# Altium schematic sheet Zynq.SchDoc
size A3; SheetNumber: 2; SheetTotal: 3
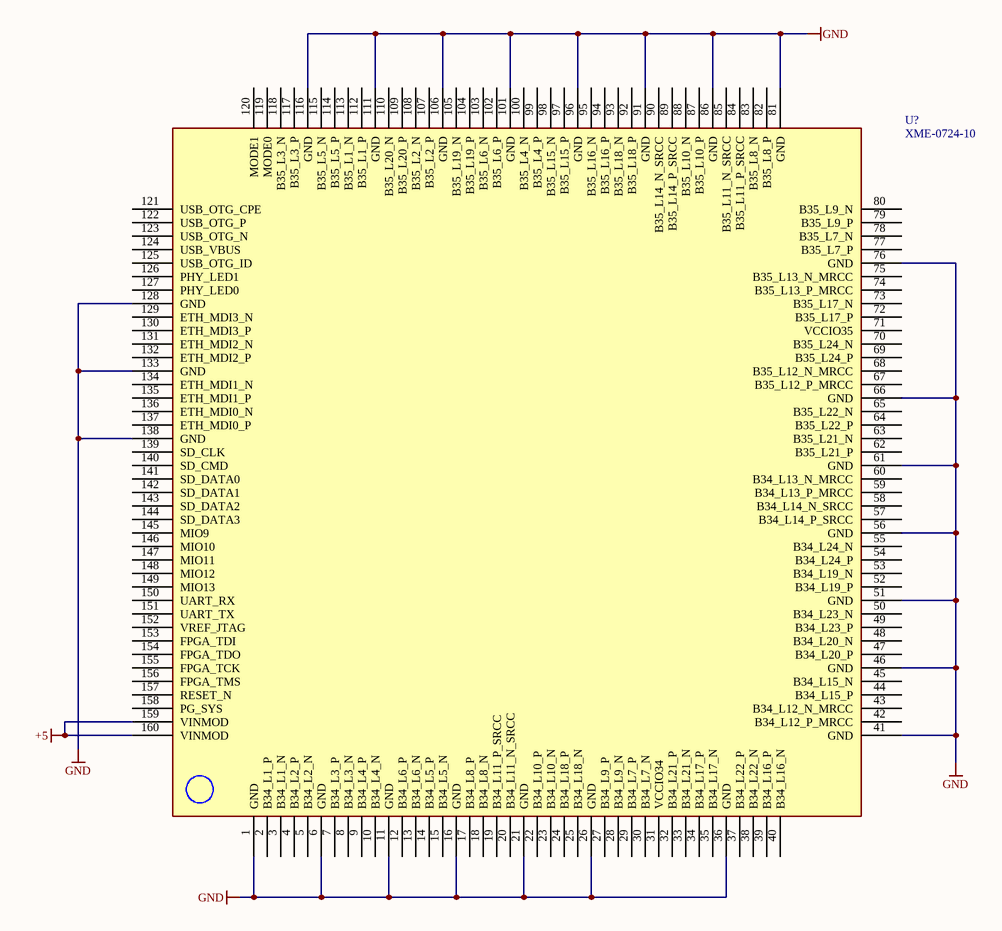
[diagram p0: Zynq.SchDoc]

## Parts
U?  XME-0724-10  [XME-0724-10-Footprint-1]

## Nets
+5: U?.159(VINMOD) U?.160(VINMOD)
GND: U?.1(GND) U?.6(GND) U?.11(GND) U?.16(GND) U?.21(GND) U?.26(GND) U?.36(GND) U?.41(GND) U?.46(GND) U?.51(GND) U?.56(GND) U?.61(GND) U?.66(GND) U?.76(GND) U?.81(GND) U?.86(GND) U?.91(GND) U?.96(GND) U?.101(GND) U?.106(GND) U?.111(GND) U?.116(GND) U?.128(GND) U?.133(GND) U?.138(GND)

Not connected (* = marked no-connect by the designer): U? 2(B34_L1_P) 3(B34_L1_N) 4(B34_L2_P) 5(B34_L2_N) 7(B34_L3_P) 8(B34_L3_N) 9(B34_L4_P) 10(B34_L4_N) 12(B34_L6_P) 13(B34_L6_N) 14(B34_L5_P) 15(B34_L5_N) 17(B34_L8_P) 18(B34_L8_N) 19(B34_L11_P_SRCC) 20(B34_L11_N_SRCC) 22(B34_L10_P) 23(B34_L10_N) 24(B34_L18_P) 25(B34_L18_N) 27(B34_L9_P) 28(B34_L9_N) 29(B34_L7_P) 30(B34_L7_N) 31(VCCIO34) 32(B34_L21_P) 33(B34_L21_N) 34(B34_L17_P) 35(B34_L17_N) 37(B34_L22_P) 38(B34_L22_N) 39(B34_L16_P) 40(B34_L16_N) 42(B34_L12_P_MRCC) 43(B34_L12_N_MRCC) 44(B34_L15_P) 45(B34_L15_N) 47(B34_L20_P) 48(B34_L20_N) 49(B34_L23_P) 50(B34_L23_N) 52(B34_L19_P) 53(B34_L19_N) 54(B34_L24_P) 55(B34_L24_N) 57(B34_L14_P_SRCC) 58(B34_L14_N_SRCC) 59(B34_L13_P_MRCC) 60(B34_L13_N_MRCC) 62(B35_L21_P) 63(B35_L21_N) 64(B35_L22_P) 65(B35_L22_N) 67(B35_L12_P_MRCC) 68(B35_L12_N_MRCC) 69(B35_L24_P) 70(B35_L24_N) 71(VCCIO35) 72(B35_L17_P) 73(B35_L17_N) 74(B35_L13_P_MRCC) 75(B35_L13_N_MRCC) 77(B35_L7_P) 78(B35_L7_N) 79(B35_L9_P) 80(B35_L9_N) 82(B35_L8_P) 83(B35_L8_N) 84(B35_L11_P_SRCC) 85(B35_L11_N_SRCC) 87(B35_L10_P) 88(B35_L10_N) 89(B35_L14_P_SRCC) 90(B35_L14_N_SRCC) 92(B35_L18_P) 93(B35_L18_N) 94(B35_L16_P) 95(B35_L16_N) 97(B35_L15_P) 98(B35_L15_N) 99(B35_L4_P) 100(B35_L4_N) 102(B35_L6_P) 103(B35_L6_N) 104(B35_L19_P) 105(B35_L19_N) 107(B35_L2_P) 108(B35_L2_N) 109(B35_L20_P) 110(B35_L20_N) 112(B35_L1_P) 113(B35_L1_N) 114(B35_L5_P) 115(B35_L5_N) 117(B35_L3_P) 118(B35_L3_N) 119(MODE0) 120(MODE1) 121(USB_OTG_CPE) 122(USB_OTG_P) 123(USB_OTG_N) 124(USB_VBUS) 125(USB_OTG_ID) 126(PHY_LED1) 127(PHY_LED0) 129(ETH_MDI3_N) 130(ETH_MDI3_P) 131(ETH_MDI2_N) 132(ETH_MDI2_P) 134(ETH_MDI1_N) 135(ETH_MDI1_P) 136(ETH_MDI0_N) 137(ETH_MDI0_P) 139(SD_CLK) 140(SD_CMD) 141(SD_DATA0) 142(SD_DATA1) 143(SD_DATA2) 144(SD_DATA3) 145(MIO9) 146(MIO10) 147(MIO11) 148(MIO12) 149(MIO13) 150(UART_RX) 151(UART_TX) 152(VREF_JTAG) 153(FPGA_TDI) 154(FPGA_TDO) 155(FPGA_TCK) 156(FPGA_TMS) 157(RESET_N) 158(PG_SYS)

## Library data of the parts
U? = CMP-EMPU-00001-2: MicroPhase Zynq 7010 Module; pin to pad: 1>1+1A 2>2+2A 3>3+3A 4>4+4A 5>5+5A 6>6+6A 7>7+7A 8>8+8A 9>9+9A 10>10+10A 11>11+11A 12>12+12A 13>13+13A 14>14+14A 15>15+15A 16>16+16A 17>17+17A 18>18+18A 19>19+19A 20>20+20A 21>21+21A 22>22+22A 23>23+23A 24>24+24A 25>25+25A 26>26+26A 27>27+27A 28>28+28A 29>29+29A 30>30+30A 31>31+31A 32>32+32A 33>33+33A 34>34+34A 35>35+35A 36>36+36A 37>37+37A 38>38+38A 39>39+39A 40>40+40A 41>41+41A 42>42+42A 43>43+43A 44>44+44A 45>45+45A 46>46+46A 47>47+47A 48>48+48A 49>49+49A 50>50+50A 51>51+51A 52>52+52A 53>53+53A 54>54+54A 55>55+55A 56>56+56A 57>57+57A 58>58+58A 59>59+59A 60>60+60A 61>61+61A 62>62+62A 63>63+63A 64>64+64A 65>65+65A 66>66+66A 67>67+67A 68>68+68A 69>69+69A 70>70+70A 71>71+71A 72>72+72A 73>73+73A 74>74+74A 75>75+75A 76>76+76A 77>77+77A 78>78+78A 79>79+79A 80>80+80A 81>81+81A 82>82+82A 83>83+83A 84>84+84A 85>85+85A 86>86+86A 87>87+87A 88>88+88A 89>89+89A 90>90+90A 91>91+91A 92>92+92A 93>93+93A 94>94+94A 95>95+95A 96>96+96A 97>97+97A 98>98+98A 99>99+99A 100>100+100A 101>101+101A 102>102+102A 103>103+103A 104>104+104A 105>105+105A 106>106+106A 107>107+107A 108>108+108A 109>109+109A 110>110+110A 111>111+111A 112>112+112A 113>113+113A 114>114+114A 115>115+115A 116>116+116A 117>117+117A 118>118+118A 119>119+119A 120>120+120A 121>121+121A 122>122+122A 123>123+123A 124>124+124A 125>125+125A 126>126+126A 127>127+127A 128>128+128A 129>129+129A 130>130+130A 131>131+131A 132>132+132A 133>133+133A 134>134+134A 135>135+135A 136>136+136A 137>137+137A 138>138+138A 139>139+139A 140>140+140A 141>141+141A 142>142+142A 143>143+143A 144>144+144A 145>145+145A 146>146+146A 147>147+147A 148>148+148A 149>149+149A 150>150+150A 151>151+151A 152>152+152A 153>153+153A 154>154+154A 155>155+155A 156>156+156A 157>157+157A 158>158+158A 159>159+159A 160>160+160A